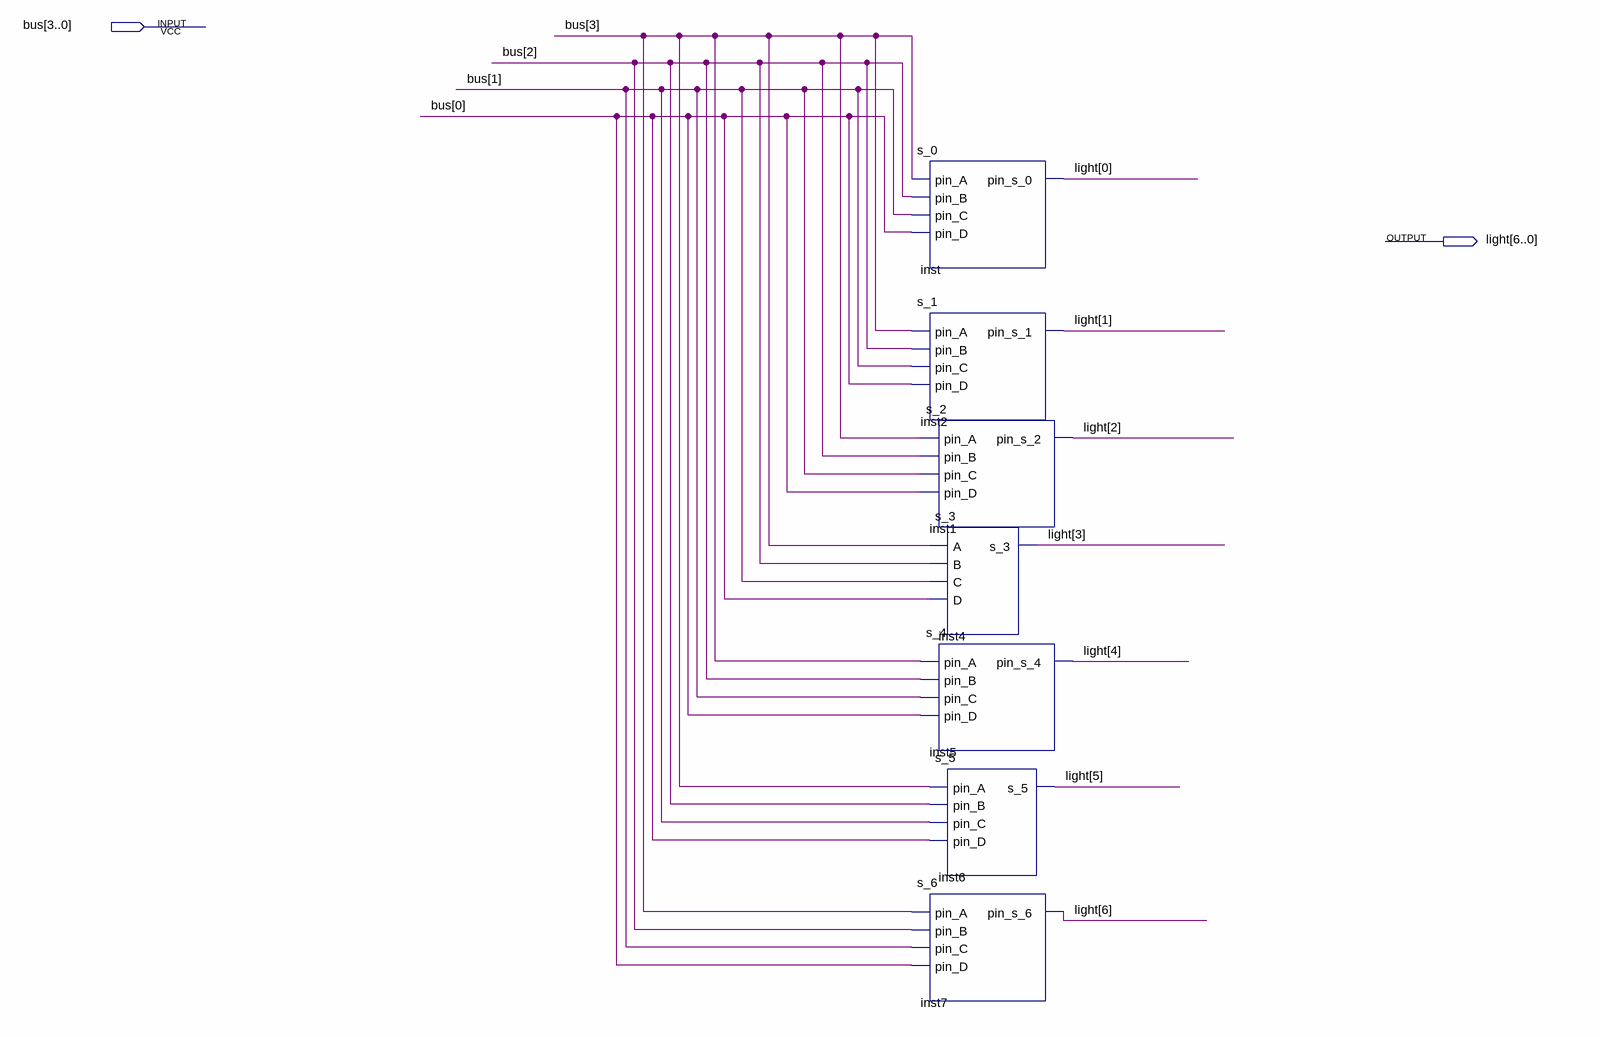
[diagram p0: schematic sheet]
// Quartus schematic lab_4_1 - Copy.bdf as structural Verilog: 7 symbols, 2 pins
module \lab_4_1_-_Copy  (
  input  [3:0] bus,
  output [6:0] light
);

  s_0 inst (.pin_A(bus[3]), .pin_B(bus[2]), .pin_C(bus[1]), .pin_D(bus[0]), .pin_s_0(light[0]));
  s_1 inst2 (.pin_A(bus[3]), .pin_B(bus[2]), .pin_C(bus[1]), .pin_D(bus[0]), .pin_s_1(light[1]));
  s_2 inst1 (.pin_A(bus[3]), .pin_B(bus[2]), .pin_C(bus[1]), .pin_D(bus[0]), .pin_s_2(light[2]));
  s_3 inst4 (.A(bus[3]), .B(bus[2]), .C(bus[1]), .D(bus[0]), .s_3(light[3]));
  s_4 inst5 (.pin_A(bus[3]), .pin_B(bus[2]), .pin_C(bus[1]), .pin_D(bus[0]), .pin_s_4(light[4]));
  s_5 inst6 (.pin_A(bus[3]), .pin_B(bus[2]), .pin_C(bus[1]), .pin_D(bus[0]), .s_5(light[5]));
  s_6 inst7 (.pin_A(bus[3]), .pin_B(bus[2]), .pin_C(bus[1]), .pin_D(bus[0]), .pin_s_6(light[6]));
endmodule
